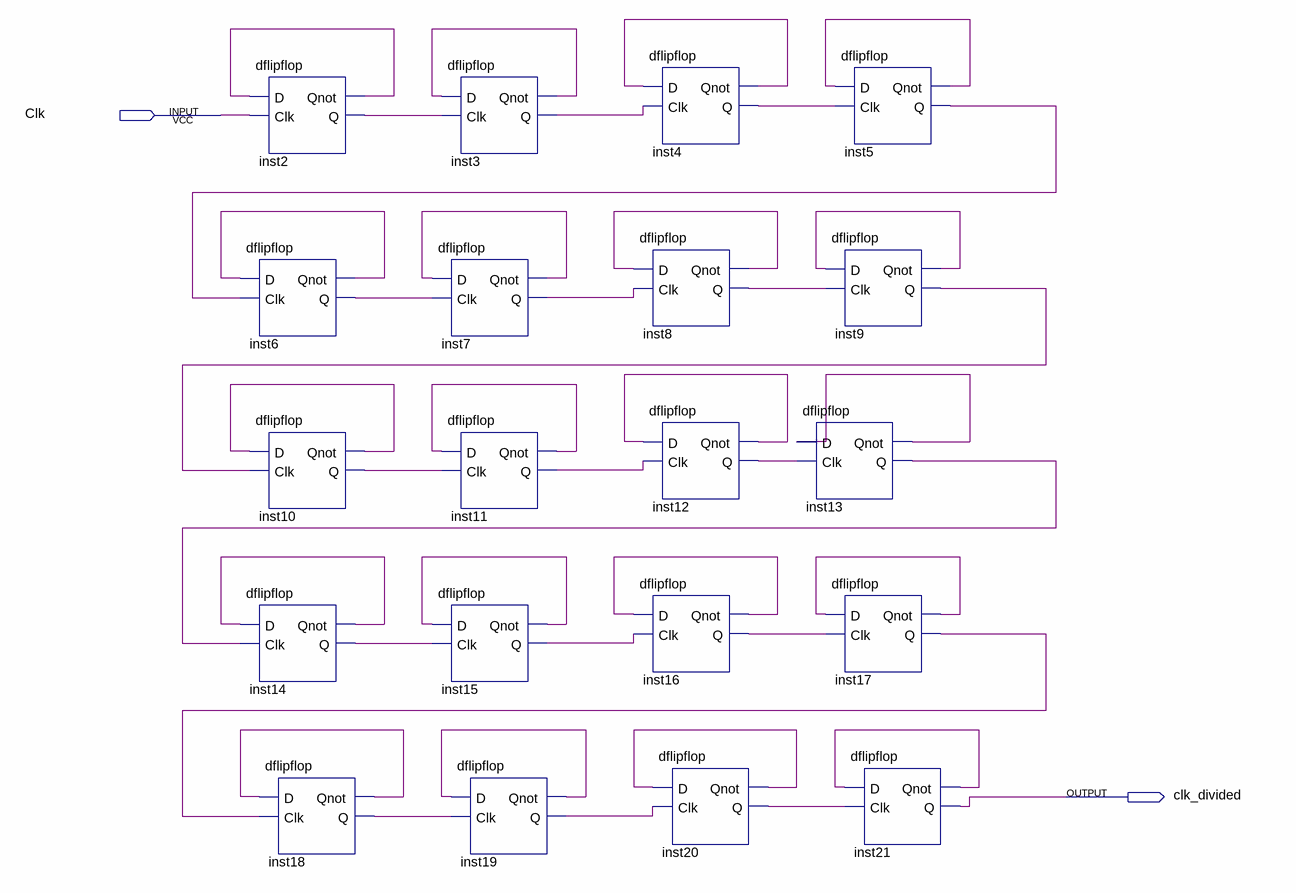
[diagram p0: schematic sheet]
// Quartus schematic clockdivider2-20.bdf as structural Verilog: 20 symbols, 2 pins
module \clockdivider2-20  (
  input  Clk,
  output clk_divided
);

  wire inst2_q, inst2_qnot, inst3_q, inst3_qnot, inst4_q, inst4_qnot, inst5_q, inst5_qnot, inst6_q,
       inst6_qnot, inst7_q, inst7_qnot, inst8_q, inst8_qnot, inst9_q, inst9_qnot, inst10_q, inst10_qnot,
       inst11_q, inst11_qnot, inst12_q, inst12_qnot, inst13_q, inst13_qnot, inst14_q, inst14_qnot, inst15_q,
       inst15_qnot, inst16_q, inst16_qnot, inst17_q, inst17_qnot, inst18_q, inst18_qnot, inst19_q,
       inst19_qnot, inst20_q, inst20_qnot, inst21_qnot;

  dflipflop inst2 (.D(inst2_qnot), .Clk(Clk), .Qnot(inst2_qnot), .Q(inst2_q));
  dflipflop inst6 (.D(inst6_qnot), .Clk(inst5_q), .Qnot(inst6_qnot), .Q(inst6_q));
  dflipflop inst10 (.D(inst10_qnot), .Clk(inst9_q), .Qnot(inst10_qnot), .Q(inst10_q));
  dflipflop inst14 (.D(inst14_qnot), .Clk(inst13_q), .Qnot(inst14_qnot), .Q(inst14_q));
  dflipflop inst18 (.D(inst18_qnot), .Clk(inst17_q), .Qnot(inst18_qnot), .Q(inst18_q));
  dflipflop inst3 (.D(inst3_qnot), .Clk(inst2_q), .Qnot(inst3_qnot), .Q(inst3_q));
  dflipflop inst7 (.D(inst7_qnot), .Clk(inst6_q), .Qnot(inst7_qnot), .Q(inst7_q));
  dflipflop inst11 (.D(inst11_qnot), .Clk(inst10_q), .Qnot(inst11_qnot), .Q(inst11_q));
  dflipflop inst15 (.D(inst15_qnot), .Clk(inst14_q), .Qnot(inst15_qnot), .Q(inst15_q));
  dflipflop inst19 (.D(inst19_qnot), .Clk(inst18_q), .Qnot(inst19_qnot), .Q(inst19_q));
  dflipflop inst4 (.D(inst4_qnot), .Clk(inst3_q), .Qnot(inst4_qnot), .Q(inst4_q));
  dflipflop inst8 (.D(inst8_qnot), .Clk(inst7_q), .Qnot(inst8_qnot), .Q(inst8_q));
  dflipflop inst12 (.D(inst12_qnot), .Clk(inst11_q), .Qnot(inst12_qnot), .Q(inst12_q));
  dflipflop inst16 (.D(inst16_qnot), .Clk(inst15_q), .Qnot(inst16_qnot), .Q(inst16_q));
  dflipflop inst20 (.D(inst20_qnot), .Clk(inst19_q), .Qnot(inst20_qnot), .Q(inst20_q));
  dflipflop inst13 (.D(inst13_qnot), .Clk(inst12_q), .Qnot(inst13_qnot), .Q(inst13_q));
  dflipflop inst5 (.D(inst5_qnot), .Clk(inst4_q), .Qnot(inst5_qnot), .Q(inst5_q));
  dflipflop inst9 (.D(inst9_qnot), .Clk(inst8_q), .Qnot(inst9_qnot), .Q(inst9_q));
  dflipflop inst17 (.D(inst17_qnot), .Clk(inst16_q), .Qnot(inst17_qnot), .Q(inst17_q));
  dflipflop inst21 (.D(inst21_qnot), .Clk(inst20_q), .Qnot(inst21_qnot), .Q(clk_divided));
endmodule
